# Altium schematic sheet USB.SchDoc
size A4; SheetNumber: 5; SheetTotal: 5
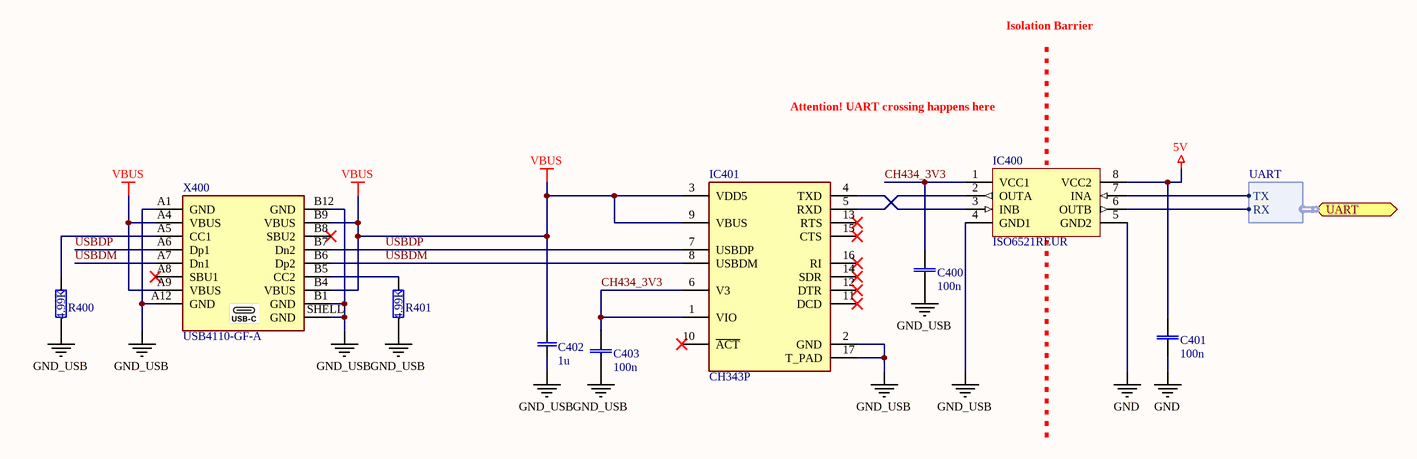
[diagram p0: USB.SchDoc]

## Parts
C400  100n  [CAP0402]
C401  100n  [CAP0402]
C402  1u  [0603]
C403  100n  [CAP0402]
IC400  ISO6521REUR  [VSON8(ISO6521REUR)]
IC401  CH343P  [QFN16_3X3]
R400  RC0402FR-074K99L  [RES0402]  (value not drawn)
R401  RC0402FR-074K99L  [RES0402]  (value not drawn)
X400  USB4110-GF-A  [USB4110]

## Ports
UART (bidir, harness UART, see Overview[1C])

## Harnesses
UART: RX, TX

## Nets
5V: C401.1 IC400.8(VCC2)
GND: C401.2 IC400.5(GND2)
GND_USB: C400.2 C402.1 C403.2 IC400.4(GND1) IC401.2(GND) IC401.17(T_PAD) R400.1 R401.1 X400.A1(GND) X400.A12(GND) X400.B1(GND) X400.B12(GND) X400.SHELL(GND)
VBUS: C402.2 IC401.3(VDD5) IC401.9(VBUS) X400.A4(VBUS) X400.A9(VBUS) X400.B4(VBUS) X400.B9(VBUS)
CH434_3V3: C400.1 C403.1 IC400.1(VCC1) IC401.1(VIO) IC401.6(V3)
USBDM: IC401.8(USBDM) X400.A7(Dn1) X400.B6(Dp2)
USBDP: IC401.7(USBDP) X400.A6(Dp1) X400.B7(Dn2)
NetIC400_2: IC400.2(OUTA) IC401.5(RXD)
NetIC400_3: IC400.3(INB) IC401.4(TXD)
NetIC400_6: IC400.6(OUTB) ; port UART.RX
NetIC400_7: IC400.7(INA) ; port UART.TX
NetR400_2: R400.2 X400.A5(CC1)
NetR401_2: R401.2 X400.B5(CC2)

Not connected (* = marked no-connect by the designer): IC401 10(~{ACT})* 11(DCD)* 12(DTR)* 13(RTS)* 14(SDR)* 15(CTS)* 16(RI)*; X400 A8(SBU1)* B8(SBU2)*

## Notes on the sheet
- Isolation Barrier
- Attention! UART crossing happens here

## Library data of the parts
C400 C401 C403 = CL05A104KA5NNNC: MaxVoltage: 25V; Dialectric: X5R; Tolerance: 10%; Value: 100n; MPN: CL05A104KA5NNNC
C402 = 000088: Part Number: 000088; Component Type: Standard; ComponentLink1Description: Datasheet; ComponentLink2Description: Manufacturer Site; Value: 1u
IC401 = CH343P: Manufacturer: WCH; JLCPCB Part #: C2846043; Manufacturer Partnummber: CH343P; MPN: CH343P
R400 R401 = RC0402FR-074K99L: Value: 4.99K; MPN: RC0402FR-074K99L
IC400 = ISO6521REUR: MPN: ISO6521REUR
X400 = USB4110-GF-A: MPN: USB4110-GF-A